# EAGLE schematic ai_icsp_connector_bottom (EAGLE 7.2.0)
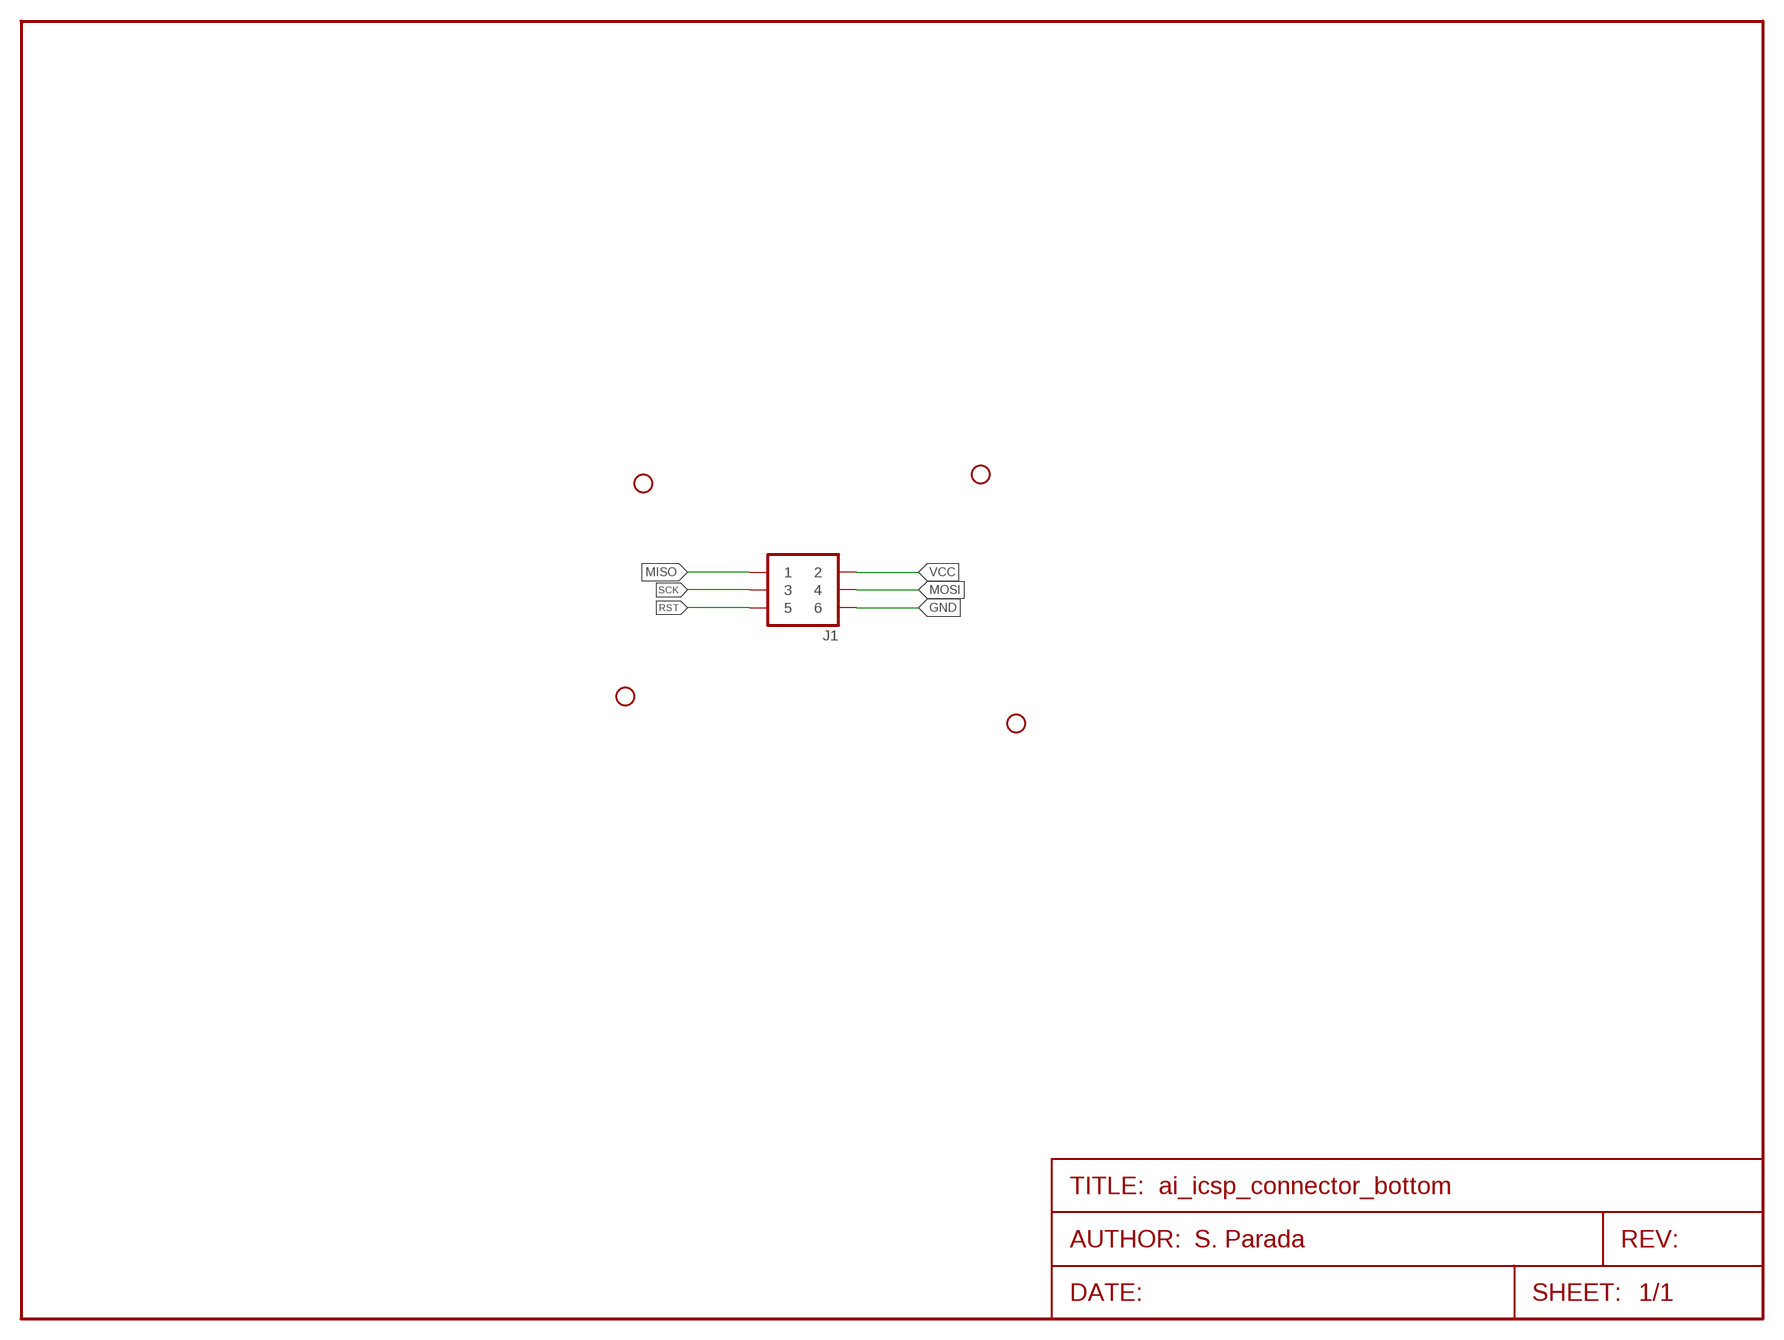
[diagram p0: schematic, sheet 1]
FRAME1 (FRAME-LETTER): AUTHOR: S. Parada

## Parts
J1  2X032X03-ICSP  [2X03-ICSP]
STANDOFF1  STAND-OFF4  [STAND-OFF-4]
STANDOFF2  STAND-OFF4  [STAND-OFF-4]
STANDOFF3  STAND-OFF4  [STAND-OFF-4]
STANDOFF4  STAND-OFF4  [STAND-OFF-4]

## Nets
GND: J1.6
MISO: J1.1
MOSI: J1.4
RST: J1.5
SCK: J1.3
VCC: J1.2

## Library data of the parts
J1 = Ai_Connectors:2X03
STANDOFF1-STANDOFF4 = Ai_Electromechanical:STAND-OFF: Size #4